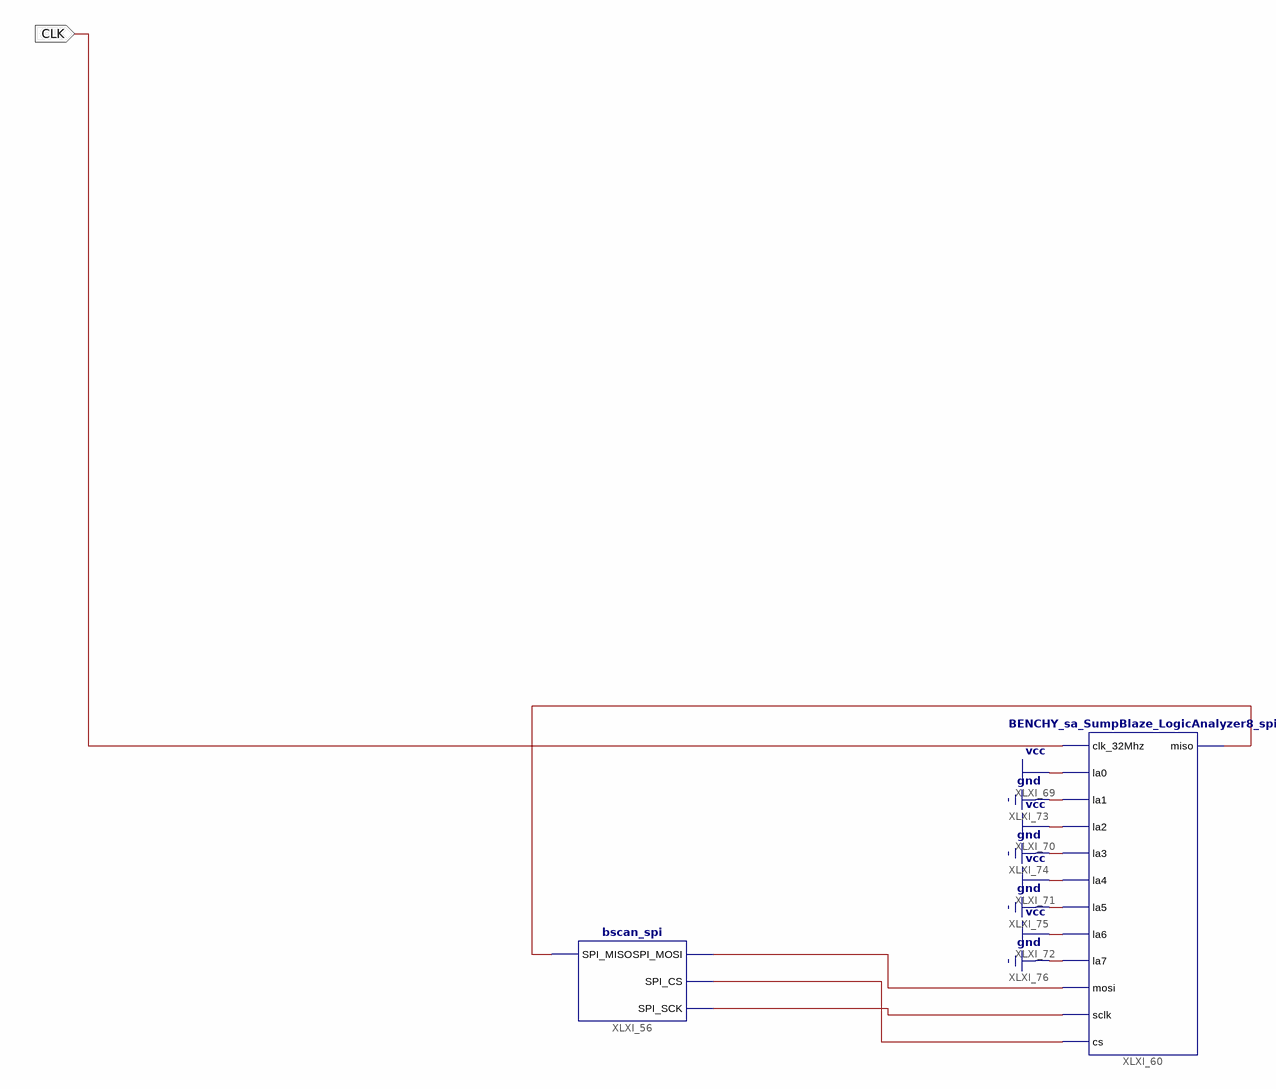
[diagram p0: schematic sheet 1]
// Xilinx ISE schematic Papilio_Pro.sch (spartan6) as structural Verilog: 2 symbols, 1 ports
module Papilio_Pro (
  input  CLK
);

  wire XLXN_516, XLXN_517, XLXN_518, XLXN_519;

  bscan_spi XLXI_56 (.SPI_MISO(XLXN_519), .SPI_MOSI(XLXN_516), .SPI_CS(XLXN_517), .SPI_SCK(XLXN_518));
  BENCHY_sa_SumpBlaze_LogicAnalyzer8_spi XLXI_60 (
    .clk_32Mhz(CLK), .la0(1'b1), .la1(1'b0), .la2(1'b1), .la3(1'b0), .la4(1'b1), .la5(1'b0), .la6(1'b1),
    .la7(1'b0), .mosi(XLXN_516), .sclk(XLXN_518), .cs(XLXN_517), .miso(XLXN_519));
endmodule
